# Altium schematic sheet 1.power.SchDoc: 文档标题
size A4; DrawnBy: 创建者; Organization: Seneasy; DocumentNumber: 项目编号; Revision: 版本号; SheetNumber: 1; SheetTotal: 2; Time: 创建时间
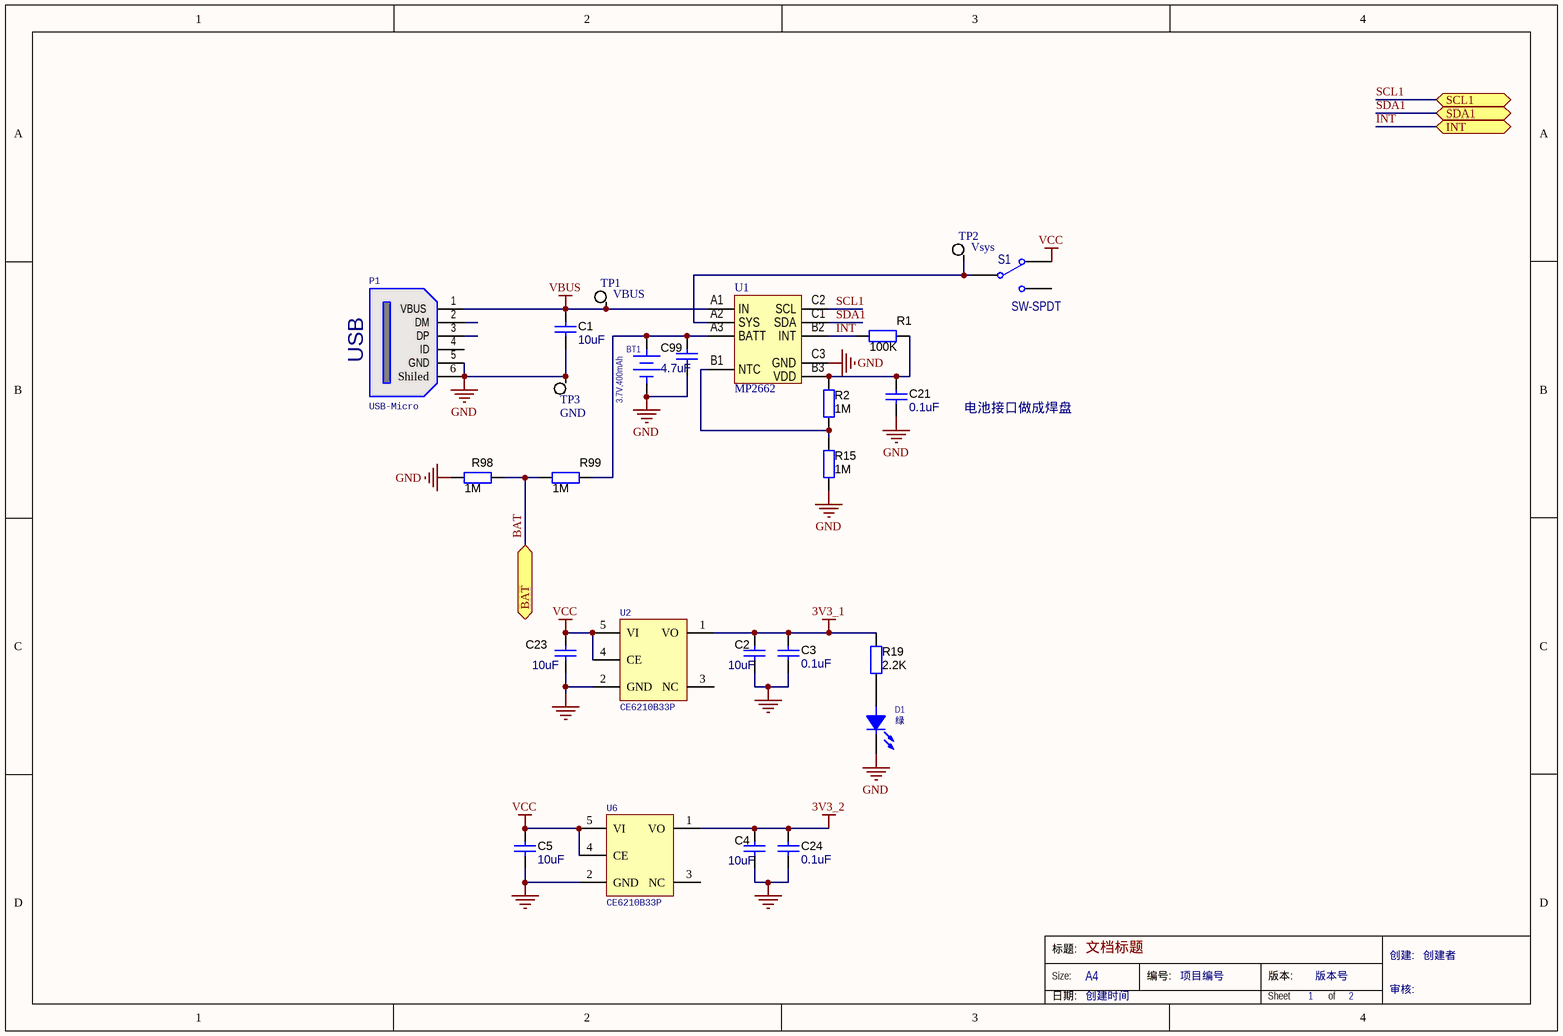
[diagram p0: 1.power.SchDoc]

## Parts
BT1  3.7V,400mAh  [焊盘]
C1  10uF  [0603]
C2  10uF  [0603]
C3  0.1uF  [0402]
C4  10uF  [0603]
C5  10uF  [0603]
C21  0.1uF  [0603]
C23  10uF  [0603]
C24  0.1uF  [0402]
C99  4.7uF  [0603]
D1  绿  [0603LED]
P1  USB-Micro  [MICRO_USB2]
R1  100K  [0402]
R2  1M  [0402]
R15  1M  [0402]
R19  2.2K  [0402]
R98  1M  [0402]
R99  1M  [0402]
S1  SW-SPDT  [SW2]
TP1  VBUS  [测试点]
TP2  Vsys  [测试点]
TP3  GND  [测试点]
U1  MP2662  [WLCSP-9]
U2  CE6210B33P  [SOT89-5]
U6  CE6210B33P  [SOT89-5]

## Ports
BAT (bidir), INT (bidir), SCL1 (bidir), SDA1 (bidir)

## Nets
3V3_1: C2.1 C3.2 R19.1 U2.1(VO)
3V3_2: C4.1 C24.2 U6.1(VO)
GND: BT1.2(-) C1.2 C2.2 C3.1 C4.2 C5.2 C21.2 C23.2 C24.1 C99.2 D1.C(CATHODE) P1.5(GND) P1.6(Shiled) R15.2 R98.1 TP3.1 U1.C3(GND) U2.2(GND) U6.2(GND)
VBUS: C1.1 P1.1(VBUS) TP1.1 U1.A1(IN)
VCC: C5.1 C23.1 S1.3 U2.4(CE) U2.5(VI) U6.4(CE) U6.5(VI)
BAT: R98.2 R99.1 ; port BAT
INT: R1.1 U1.B2(INT) ; port INT
SCL1: U1.C2(SCL) ; port SCL1
SDA1: U1.C1(SDA) ; port SDA1
NetBT1_1: BT1.1(+) C99.1 R99.2 U1.A3(BATT)
NetC21_1: C21.1 R1.2 R2.1 U1.B3(VDD)
NetD1_A: D1.A(ANODE) R19.2
NetR2_2: R2.2 R15.1 U1.B1(NTC)
NetS1_2: S1.2 TP2.1 U1.A2(SYS)

Not connected (* = marked no-connect by the designer): P1 2(DM) 3(DP) 4(ID); S1 1; U2 3(NC); U6 3(NC)

## Notes on the sheet
- USB
- 电池接口做成焊盘
- 标题:
- Size:
- A4
- 编号:
- 版本:
- 创建:
- 日期:
- Sheet
- of
- 审核:

## Library data of the parts
BT1 = Battery: 4.2V Li-lon; Manufacturer: ?; PackageReference: ?; Value: ?; PartNumber: ?; ComponentLink1URL: ?
C1-C5 C21 C23 C24 C99 = CAP1_npol: CAP, CERM, 0.01uF, 100V, +/-5%, X7R, 0603; PartNumber: 06031C103JAT2A; Manufacturer: AVX; Polarized: N; Tolerance: 5; ESR_Ohm: 0.098; Voltage Rating DC: 25V; RoHS Compliant: Y; MountType: SMT; Dielectric: X7R; ComponentLink1URL: http://www.avx.com/docs/masterpubs/smccp.pdf; Operating Temperature: -55+125C; PackageReference: 0603
  C1 C2 C4 C5 C23: Value: 10uF
  C3 C21 C24: Value: 0.1uF
  C99: Value: 4.7uF
D1 = LED1: Manufacturer: ?; PackageReference: ?; PartNumber: ?; Value: ?
P1 = USB-Micro: USB Connector
R1 R2 R15 R19 R98 R99 = RES1: RES, 1.0k ohm, 5%, 0.1W, 0603; PartNumber: RC0603JR-071KL; Manufacturer: Yageo America; CompType: Resistor; Res_ohm: 1000; Value_Code: 1k00; Tolerance_%: 5; Power_W: 0.1; VDC_V: 50; TempCo: 100 ppm/C; EIA_Code: E24; U/M: EA; SymbolVersion: 2009-05-29; RoHS: Y; Value1: 5%; Value2: 0.1W; MountType: SMT; Technology: Thick Film; Published: 2008-06-26; Publisher: Texas Instruments; LatestRevisionDate: 2014-04-18; ComponentLink1Description: Datasheet link; ComponentLink1URL: http://www.yageo.com/pdf/Pu-RC0603_51_PbFree_L_2.pdf; Supplier Part Number 1: 311-1.0KGRCT-ND; Supplier 2: Mouser; Supplier Part Number 2: 603-RC0603JR-071KL; Supplier 3: Farnell; Supplier Part Number 3: 9233385; PackageReference: 0603
  R1: Value: 100K
  R2 R15 R98 R99: Value: 1M
  R19: Value: 2.2K
S1 = SW-SPDT: SPDT Subminiature Toggle Switch, Right Angle Mounting, Vertical Actuation; Published: 24-Mar-1999; LatestRevisionDate: 17-Dec-2003; LatestRevisionNote: Schematic revised, PCB Footprint replaced.; DatasheetVersion: 05-Dec-2000; PackageReference: TL36WW15050; Publisher: Altium Limited; PackageDescription: Switch; 4 Leads; ComponentLink1Description: Manufacturer Link; ComponentLink1URL: http://www.apem.com; 采购网址: http://www.cnhsdz.com/huansheng/products_content-437702.html
TP1-TP3 = TP: Test Point
U1 = MP2662: 500mA Single Cell Li-ion Battery Charger  with Power Path Management, 1mA  Termination and <1μA Battery Leakage
U2 U6 = AP2112K